# Altium schematic sheet Sheet_1_2023-01-11.schdoc
size 431 x 325 mm
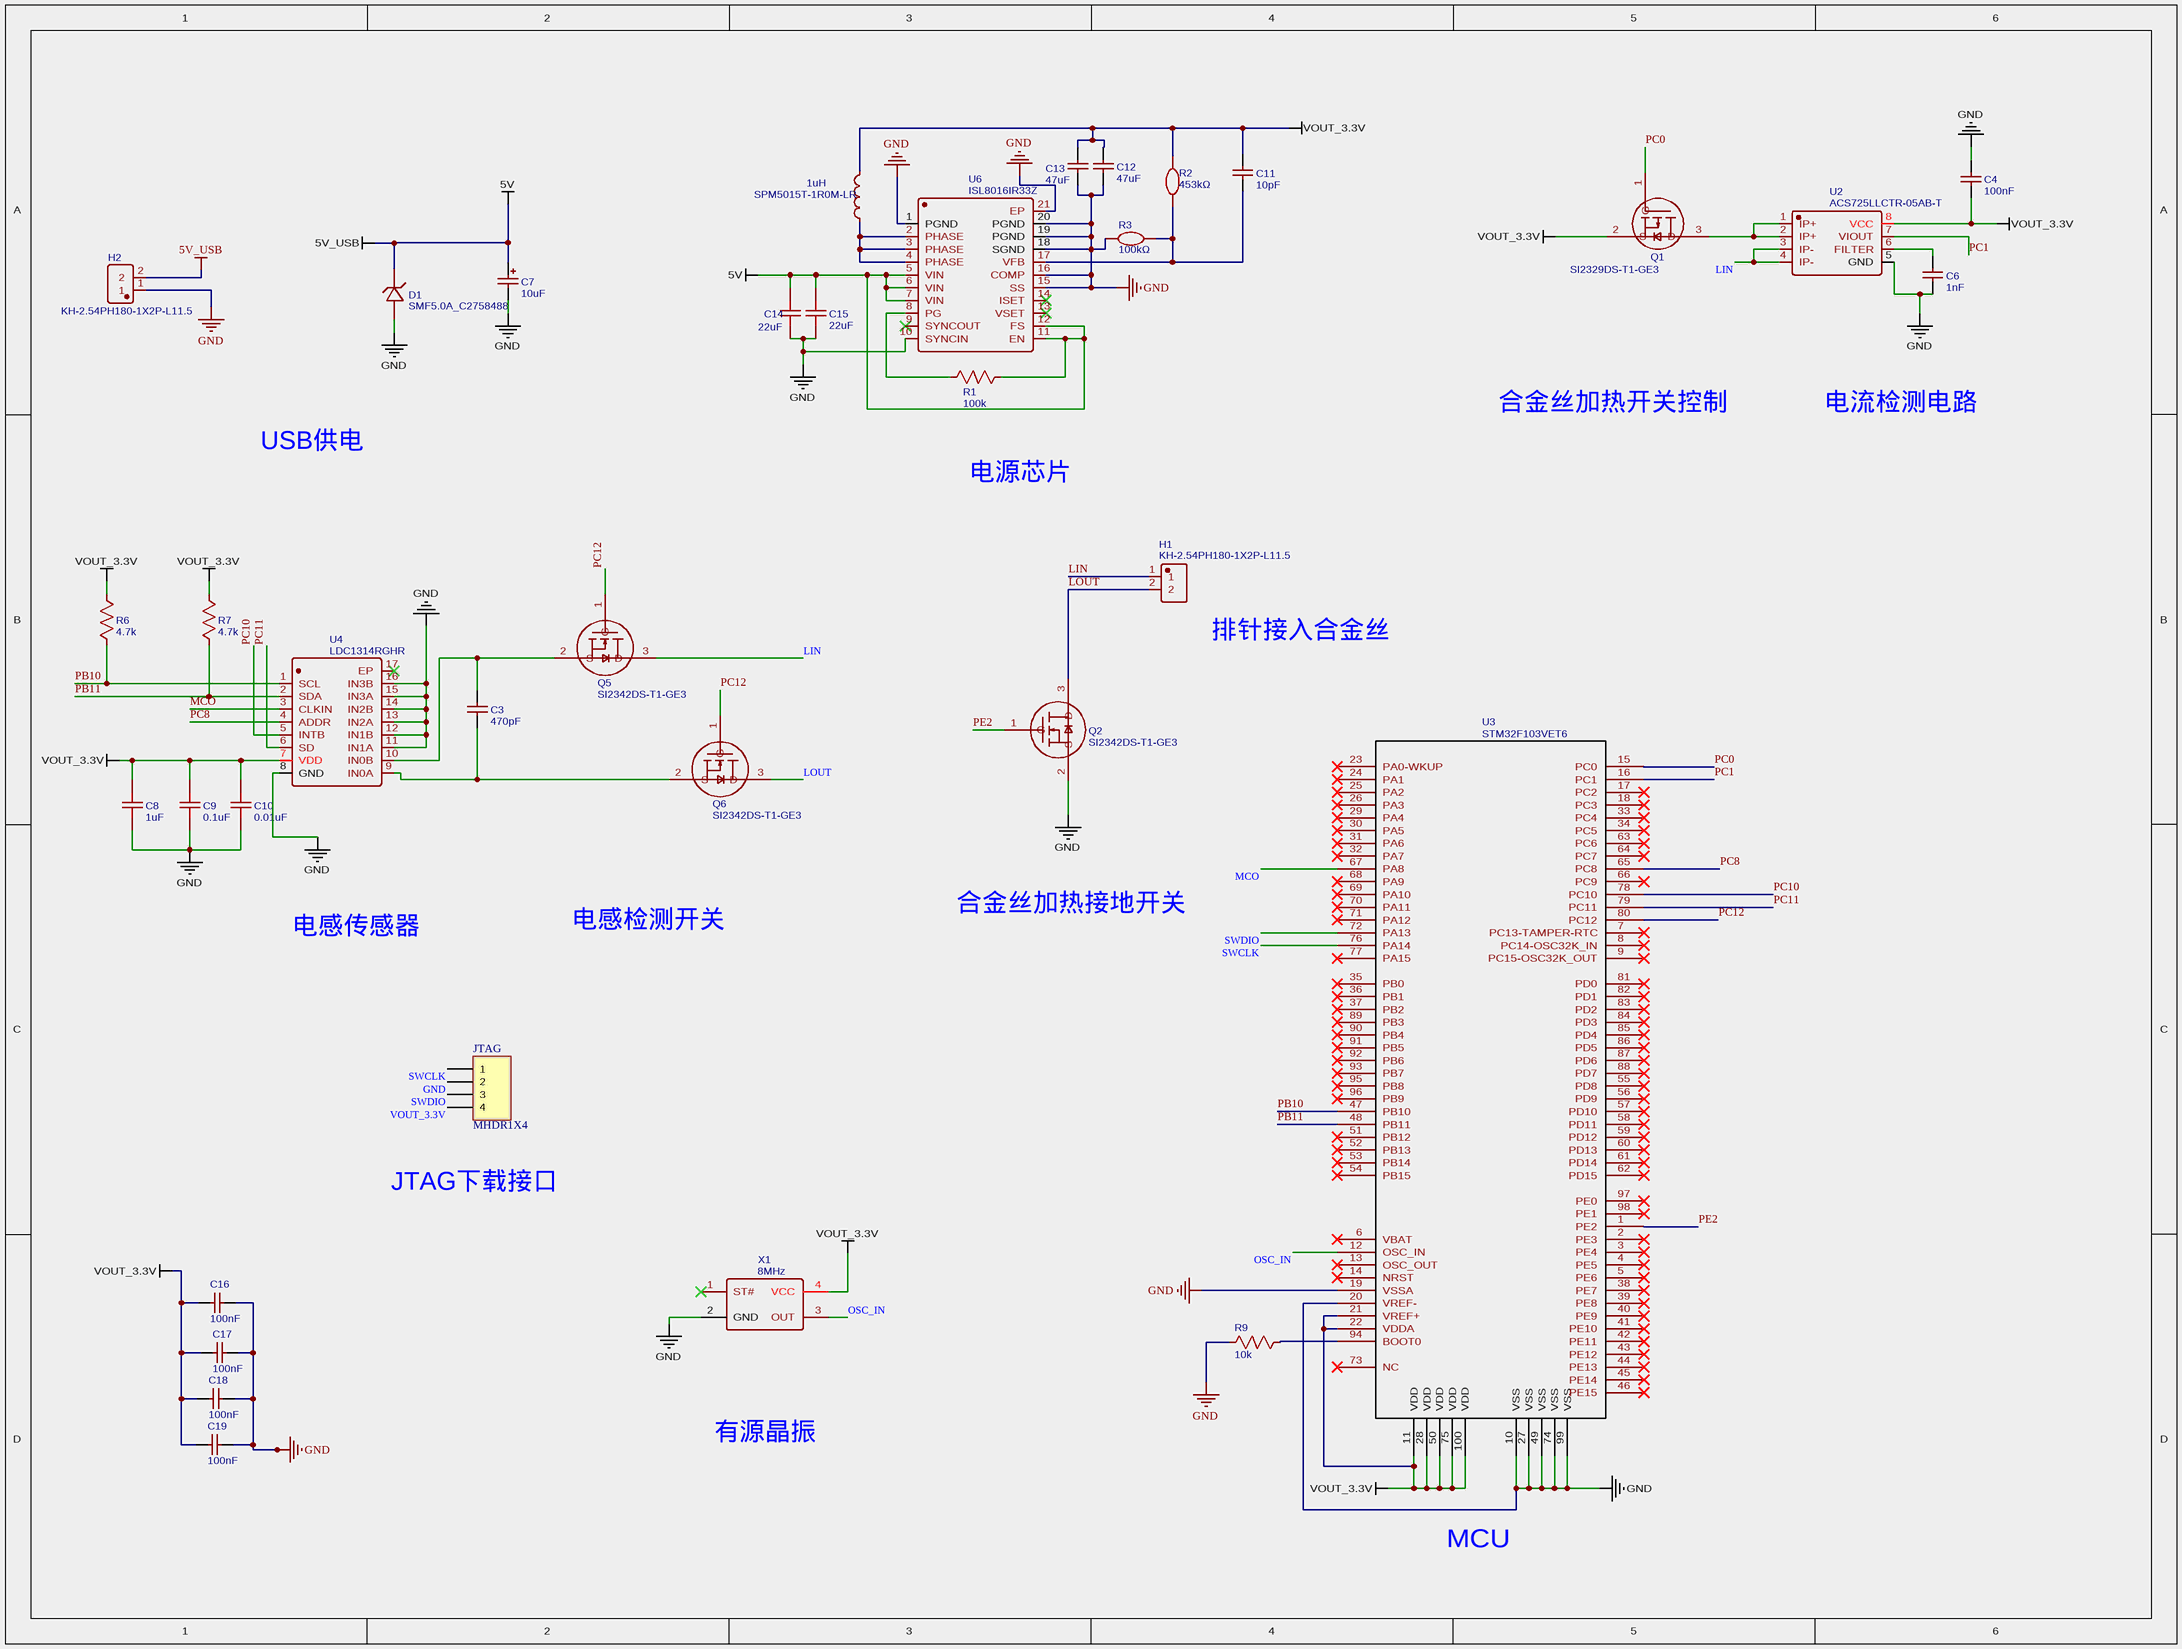
[diagram p0: Sheet_1_2023-01-11.schdoc]

## Parts
1uH  SPM5015T-1R0M-LR  [IND-SMD_L5.4-W5.1_SPM5020]
C3  470pF  [C0603]
C4  100nF  [C0402_NEW]
C6  1nF  [C0603]
C7  10uF  [CASE-A_3216]
C8  1uF  [C0603]
C9  0.1uF  [C0603]
C10  0.01uF  [C0603]
C11  10pF  [C0402]
C12  47uF  [C0805]
C13  47uF  [C0805]
C14  22uF  [C0603]
C15  22uF  [C0603]
C16  100nF  [C0402_NEW]
C17  100nF  [C0402_NEW]
C18  100nF  [C0402_NEW]
C19  100nF  [C0402_NEW]
D1  SMF5.0A_C2758488  [SOD-123FL_L2.7-W1.8-LS3.7-RD]
H1  KH-2.54PH180-1X2P-L11.5  [HDR-TH_2P-P2.54-V-M]
H2  KH-2.54PH180-1X2P-L11.5  [HDR-TH_2P-P2.54-V-M]
JTAG  MHDR1X4  [MHDR1X4]
Q1  SI2329DS-T1-GE3  [SOT-23_L2.9-W1.3-P1.90-LS2.4-BR]
Q2  SI2342DS-T1-GE3  [SOT-23_L2.9-W1.3-P1.90-LS2.4-BR]
Q5  SI2342DS-T1-GE3  [SOT-23_L2.9-W1.3-P1.90-LS2.4-BR]
Q6  SI2342DS-T1-GE3  [SOT-23_L2.9-W1.3-P1.90-LS2.4-BR]
R1  100k  [R0603]
R2  453kΩ  [R0402]
R3  100kΩ  [R0402]
R6  4.7k  [R0603]
R7  4.7k  [R0603]
R9  10k  [R0603]
U2  ACS725LLCTR-05AB-T  [SOIC-8_L5.0-W4.0-P1.27-LS6.1-BL]
U3  STM32F103VET6  [LQFP-100_L14.0-W14.0-P0.50-LS16.0-BL]
U4  LDC1314RGHR  [QFN-16_L4.0-W4.0-P0.50-TL-EP2.4]
U6  ISL8016IR33Z  [QFN-20_L4.0-W3.0-P0.5-TL-EP2.7]
X1  8MHz  [OSC-SMD_4P-L3.2-W2.5-BL]

## Nets
5V: C7.1 C14.2 C15.2 D1.1(C) H2.2 R1.2 U6.5(VIN) U6.6(VIN) U6.7(VIN) U6.11(EN) U6.12(FS)  [also labelled 5V_USB]
GND: C4.2 C6.1 C7.2 C8.1 C9.1 C10.1 C12.1 C13.1 C14.1 C15.1 C16.1 C17.1 C18.1 C19.2 D1.2(A) H2.1 JTAG.2 Q2.2(S) R3.1 R9.1 U2.5(GND) U3.10(VSS) U3.19(VSSA) U3.20(VREF-) U3.27(VSS) U3.49(VSS) U3.74(VSS) U3.99(VSS) U4.8(GND) U4.11(IN1A) U4.12(IN1B) U4.13(IN2A) U4.14(IN2B) U4.15(IN3A) U4.16(IN3B) U6.1(PGND) U6.10(SYNCIN) U6.15(SS) U6.16(COMP) U6.18(SGND) U6.19(PGND) U6.20(PGND) U6.21(EP) X1.2(GND)
VOUT_3.3V: 1uH.2 C4.1 C8.2 C9.2 C10.2 C11.1 C12.2 C13.2 C16.2 C17.2 C18.2 C19.1 JTAG.4 Q1.2(S) R2.2 R6.2 R7.2 U2.8(VCC) U3.11(VDD) U3.21(VREF+) U3.22(VDDA) U3.28(VDD) U3.50(VDD) U3.75(VDD) U3.100(VDD) U4.7(VDD) X1.4(VCC)
LIN: H1.1 Q5.3(D) U2.3(IP-) U2.4(IP-)
LOUT: H1.2 Q2.3(D) Q6.3(D)
MCO: U3.67(PA8) U4.3(CLKIN)
OSC_IN: U3.12(OSC_IN) X1.3(OUT)
PB10: R6.1 U3.47(PB10) U4.1(SCL)
PB11: R7.1 U3.48(PB11) U4.2(SDA)
PC0: Q1.1(G) U3.15(PC0)
PC1: U2.7(VIOUT) U3.16(PC1)
PC8: U3.65(PC8) U4.4(ADDR)
PC10: U3.78(PC10) U4.5(INTB)
PC11: U3.79(PC11) U4.6(SD)
PC12: Q5.1(G) Q6.1(G) U3.80(PC12)
PE2: Q2.1(G) U3.1(PE2)
SWCLK: JTAG.1 U3.76(PA14)
SWDIO: JTAG.3 U3.72(PA13)
Net1uH_1: 1uH.1 U6.2(PHASE) U6.3(PHASE) U6.4(PHASE)
NetC3_1: C3.1 Q6.2(S) U4.9(IN0A)
NetC3_2: C3.2 Q5.2(S) U4.10(IN0B)
NetC6_2: C6.2 U2.6(FILTER)
NetC11_2: C11.2 R2.1 R3.2 U6.17(VFB)
NetQ1_3: Q1.3(D) U2.1(IP+) U2.2(IP+)
NetR1_1: R1.1 U6.8(PG)
NetR9_2: R9.2 U3.94(BOOT0)

Not connected (* = marked no-connect by the designer): U3 2(PE3)* 3(PE4)* 4(PE5)* 5(PE6)* 6(VBAT)* 7(PC13-TAMPER-RTC)* 8(PC14-OSC32K_IN)* 9(PC15-OSC32K_OUT)* 13(OSC_OUT)* 14(NRST)* 17(PC2)* 18(PC3)* 23(PA0-WKUP)* 24(PA1)* 25(PA2)* 26(PA3)* 29(PA4)* 30(PA5)* 31(PA6)* 32(PA7)* 33(PC4)* 34(PC5)* 35(PB0)* 36(PB1)* 37(PB2)* 38(PE7)* 39(PE8)* 40(PE9)* 41(PE10)* 42(PE11)* 43(PE12)* 44(PE13)* 45(PE14)* 46(PE15)* 51(PB12)* 52(PB13)* 53(PB14)* 54(PB15)* 55(PD8)* 56(PD9)* 57(PD10)* 58(PD11)* 59(PD12)* 60(PD13)* 61(PD14)* 62(PD15)* 63(PC6)* 64(PC7)* 66(PC9)* 68(PA9)* 69(PA10)* 70(PA11)* 71(PA12)* 73(NC)* 77(PA15)* 81(PD0)* 82(PD1)* 83(PD2)* 84(PD3)* 85(PD4)* 86(PD5)* 87(PD6)* 88(PD7)* 89(PB3)* 90(PB4)* 91(PB5)* 92(PB6)* 93(PB7)* 95(PB8)* 96(PB9)* 97(PE0)* 98(PE1)*; U4 17(EP)*; U6 9(SYNCOUT)* 13(VSET)* 14(ISET)*; X1 1(ST#)*

## Notes on the sheet
- USB供电
- 合金丝加热开关控制
- 电流检测电路
- 电源芯片
- 排针接入合金丝
- 电感传感器
- 电感检测开关
- 合金丝加热接地开关
- JTAG下载接口
- 有源晶振
- MCU

## Library data of the parts
1uH = SPM5015T-1R0M-LR: BOM_Manufacturer: TDK; Inductance: 1uH; Contributor: LCSC; BOM_Supplier: LCSC; BOM_Supplier Part: C1329923; BOM_Manufacturer Part: SPM5015T-1R0M-LR; BOM_JLCPCB Part Class: Extended Part; spicePre: U; spiceSymbolName: SPM5015T-1R0M-LR
C3 = 470pF: BOM_Manufacturer: YAGEO(国巨); BOM_Manufacturer Part: CC0603KRX7R9BB471; nameAlias: Capacitance; BOM_Supplier: LCSC; BOM_Supplier Part: C107092; BOM_JLCPCB Part Class: Extended Part; spicePre: C; spiceSymbolName: CC0603KRX7R9BB471
C4 C16-C19 = 100nF: BOM_Manufacturer Part: CL05B104KO5NNNC; BOM_Manufacturer: SAMSUNG(三星); nameAlias: Capacitance; BOM_Supplier: LCSC; BOM_Supplier Part: C1525; BOM_JLCPCB Part Class: Basic Part; spicePre: C; spiceSymbolName: CL05B104KO5NNNC
C6 = 1nF: BOM_Manufacturer: YAGEO(国巨); BOM_Manufacturer Part: CC0603KRX7R9BB102; nameAlias: Capacitance; BOM_Supplier: LCSC; BOM_Supplier Part: C100040; BOM_JLCPCB Part Class: Extended Part; spicePre: C; spiceSymbolName: CC0603KRX7R9BB102
C7 = 10uF: BOM_Manufacturer: Kyocera AVX; BOM_Manufacturer Part: TAJA106K010RNJ; nameAlias: Capacitance; BOM_Supplier: LCSC; BOM_Supplier Part: C7177; BOM_JLCPCB Part Class: Extended Part; spicePre: C; spiceSymbolName: TAJA106K010RNJ
C8 = 1u: nameAlias: Value(F); Contributor: LCEDA_Lib; spicePre: C; spiceSymbolName: C_0603_US
C9 = 0.1u: nameAlias: Value(F); Contributor: LCEDA_Lib; spicePre: C; spiceSymbolName: C_0603_US
C10 = 0.01u: nameAlias: Value(F); Contributor: LCEDA_Lib; spicePre: C; spiceSymbolName: C_0603_US
C11 = 10pF: BOM_Manufacturer: YAGEO(国巨); BOM_Manufacturer Part: CC0402JRNPO9BN100; nameAlias: Capacitance; BOM_Supplier: LCSC; BOM_Supplier Part: C106199; BOM_JLCPCB Part Class: Extended Part; spicePre: C; spiceSymbolName: CC0402JRNPO9BN100
C12 C13 = 47uF: BOM_Manufacturer Part: CL21A476MQYNNNE; BOM_Manufacturer: SAMSUNG(三星); nameAlias: Capacitance; BOM_Supplier: LCSC; BOM_Supplier Part: C16780; BOM_JLCPCB Part Class: Basic Part; spicePre: C; spiceSymbolName: CL21A476MQYNNNE
C14 C15 = 22uF: BOM_Manufacturer: SAMSUNG(三星); BOM_Manufacturer Part: CL10A226MQ8NRNC; nameAlias: Capacitance; BOM_Supplier: LCSC; BOM_Supplier Part: C59461; BOM_JLCPCB Part Class: Basic Part; spicePre: C; spiceSymbolName: CL10A226MQ8NRNC
D1 = SMF5.0A_C2758488: BOM_Manufacturer: UMW(广东友台半导体); Contributor: LCSC; BOM_Supplier: LCSC; BOM_Supplier Part: C2758488; BOM_Manufacturer Part: SMF5.0A; BOM_JLCPCB Part Class: Extended Part; spicePre: D; spiceSymbolName: SMF5.0A_C2758488
H1 H2 = KH-2.54PH180-1X2P-L11.5: BOM_Manufacturer: kinghelm(金航标); Contributor: LCSC; BOM_Supplier: LCSC; BOM_Supplier Part: C2905434; BOM_Manufacturer Part: KH-2.54PH180-1X2P-L11.5; BOM_JLCPCB Part Class: Extended Part; spicePre: H; spiceSymbolName: KH-2.54PH180-1X2P-L11.5
JTAG = MHDR1X4: Header, 4-Pin; LatestRevisionDate: 17-Jul-2002; LatestRevisionNote: Re-released for DXP Platform.; Publisher: Altium Limited
Q1 = SI2329DS-T1-GE3: BOM_Manufacturer: VISHAY(威世); Contributor: LCSC; BOM_Supplier: LCSC; BOM_Manufacturer Part: SI2329DS-T1-GE3; BOM_Supplier Part: C85167; BOM_JLCPCB Part Class: Extended Part; spicePre: Q; spiceSymbolName: SI2329DS-T1-GE3
Q2 Q5 Q6 = SI2342DS-T1-GE3: BOM_Manufacturer: VISHAY(威世); Contributor: LCSC; BOM_Supplier: LCSC; BOM_Manufacturer Part: SI2342DS-T1-GE3; BOM_Supplier Part: C142553; BOM_JLCPCB Part Class: Extended Part; spicePre: Q; spiceSymbolName: SI2342DS-T1-GE3
R1 = 100k: nameAlias: Value(Ω); Contributor: LCEDA_Lib; spicePre: R; spiceSymbolName: R_0603_US
R2 R3 = 450kΩ: BOM_Manufacturer: UNI-ROYAL(厚声); BOM_Manufacturer Part: 0402WGF4503TCE; Resistance (Ohms): 450K; nameAlias: Resistance; Contributor: LCSC; BOM_Supplier: LCSC; BOM_Supplier Part: C407681; BOM_JLCPCB Part Class: Extended Part; spicePre: R; spiceSymbolName: 0402WGF4503TCE
R6 R7 = 4.7k: nameAlias: Value(Ω); Contributor: LCEDA_Lib; spicePre: R; spiceSymbolName: R_0603_US
R9 = 10k: nameAlias: Value(Ω); Contributor: LCEDA_Lib; spicePre: R; spiceSymbolName: R_0603_US
U2 = ACS725LLCTR-05AB-T: BOM_Manufacturer: ALLEGRO(美国埃戈罗); Contributor: lcsc; BOM_Supplier: LCSC; BOM_Supplier Part: C3684552; BOM_Manufacturer Part: ACS725LLCTR-05AB-T; link: https://atta.szlcsc.comnull; spicePre: U; spiceSymbolName: ACS725LLCTR-05AB-T
U3 = STM32F103VET6: BOM_Manufacturer: ST(意法半导体); BOM_Supplier: LCSC; BOM_Manufacturer Part: STM32F103VET6; BOM_Supplier Part: C8308; BOM_JLCPCB Part Class: Extended Part; spicePre: U; spiceSymbolName: STM32F103VET6
U4 = LDC1314RGHR: BOM_Manufacturer: TI(德州仪器); Contributor: LCSC; BOM_Supplier: LCSC; BOM_Supplier Part: C2667027; BOM_Manufacturer Part: LDC1314RGHR; BOM_JLCPCB Part Class: Extended Part; spicePre: U; spiceSymbolName: LDC1314RGHR
U6 = ISL8016IR33Z: BOM_Manufacturer: RENESAS(瑞萨)/IDT; Contributor: lcsc; BOM_Supplier: LCSC; BOM_Supplier Part: C1356368; BOM_Manufacturer Part: ISL8016IR33Z; link: https://atta.szlcsc.comnull; BOM_JLCPCB Part Class: Extended Part; spicePre: U; spiceSymbolName: ISL8016IR33Z
X1 = 8MHz: BOM_Manufacturer: EPSON(爱普生); BOM_Manufacturer Part: Q33310F70055100; nameAlias: Frequency; BOM_Supplier: LCSC; BOM_Supplier Part: C70556; BOM_JLCPCB Part Class: Extended Part; spicePre: X; spiceSymbolName: Q33310F70055100